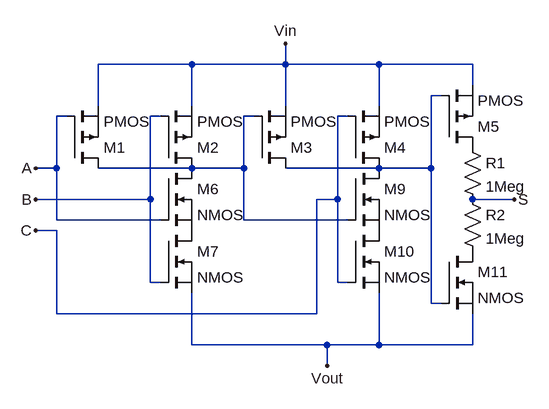
[diagram p0: schematic AND3.asc]
AND3.asc, the LTspice schematic file:
Version 4
SHEET 1 880 680
WIRE -16 -80 -160 -80
WIRE 128 -80 128 -112
WIRE 128 -80 -16 -80
WIRE 272 -80 128 -80
WIRE 416 -80 272 -80
WIRE 416 -48 416 -80
WIRE 368 -32 352 -32
WIRE -160 -16 -160 -80
WIRE -16 -16 -16 -80
WIRE 128 -16 128 -80
WIRE 272 -16 272 -80
WIRE -208 0 -224 0
WIRE -64 0 -80 0
WIRE 80 0 64 0
WIRE 224 0 208 0
WIRE -224 80 -224 0
WIRE -224 80 -256 80
WIRE -16 80 -160 80
WIRE 64 80 64 0
WIRE 64 80 -16 80
WIRE 272 80 128 80
WIRE 352 80 352 -32
WIRE 352 80 272 80
WIRE -80 128 -80 0
WIRE -80 128 -256 128
WIRE 208 128 208 0
WIRE 208 128 176 128
WIRE 480 128 416 128
WIRE -224 160 -224 80
WIRE -64 160 -224 160
WIRE 64 160 64 80
WIRE 224 160 64 160
WIRE -224 176 -256 176
WIRE -80 256 -80 128
WIRE -64 256 -80 256
WIRE 208 256 208 128
WIRE 224 256 208 256
WIRE 352 288 352 80
WIRE 368 288 352 288
WIRE -224 304 -224 176
WIRE 176 304 176 128
WIRE 176 304 -224 304
WIRE -16 352 -16 272
WIRE 192 352 -16 352
WIRE 272 352 272 272
WIRE 272 352 192 352
WIRE 416 352 416 304
WIRE 416 352 272 352
WIRE 192 384 192 352
FLAG -256 80 A
FLAG -256 128 B
FLAG -256 176 C
FLAG 128 -112 Vin
FLAG 480 128 S
FLAG 192 384 Vout
SYMBOL pmos -208 80 M180
SYMATTR InstName M1
SYMBOL pmos -64 80 M180
SYMATTR InstName M2
SYMBOL pmos 80 80 M180
SYMATTR InstName M3
SYMBOL pmos 224 80 M180
SYMATTR InstName M4
SYMBOL pmos 368 48 M180
SYMATTR InstName M5
SYMBOL nmos -64 80 R0
SYMATTR InstName M6
SYMBOL nmos -64 176 R0
SYMATTR InstName M7
SYMBOL nmos 224 80 R0
SYMATTR InstName M9
SYMBOL nmos 224 176 R0
SYMATTR InstName M10
SYMBOL nmos 368 208 R0
SYMATTR InstName M11
SYMBOL res 400 32 R0
SYMATTR InstName R1
SYMATTR Value 1Meg
SYMATTR SpiceLine tol=1 pwr=0.1
SYMBOL res 400 112 R0
SYMATTR InstName R2
SYMATTR Value 1Meg
SYMATTR SpiceLine tol=1 pwr=0.1

The netlist it stands for:
* AND3.asc
M1 N002 A Vin Vin PMOS
M2 N002 B Vin Vin PMOS
M3 N001 N002 Vin Vin PMOS
M4 N001 C Vin Vin PMOS
M5 P001 N001 Vin Vin PMOS
M6 N002 A P002 P002 NMOS
M7 P002 B Vout Vout NMOS
M9 N001 N002 P003 P003 NMOS
M10 P003 C Vout Vout NMOS
M11 P004 N001 Vout Vout NMOS
R1 P001 S 1Meg tol=1 pwr=0.1
R2 S P004 1Meg tol=1 pwr=0.1
.model NMOS NMOS
.model PMOS PMOS
.lib standard.mos
.backanno
.end